# EAGLE design MICamp (EAGLE 4.16)
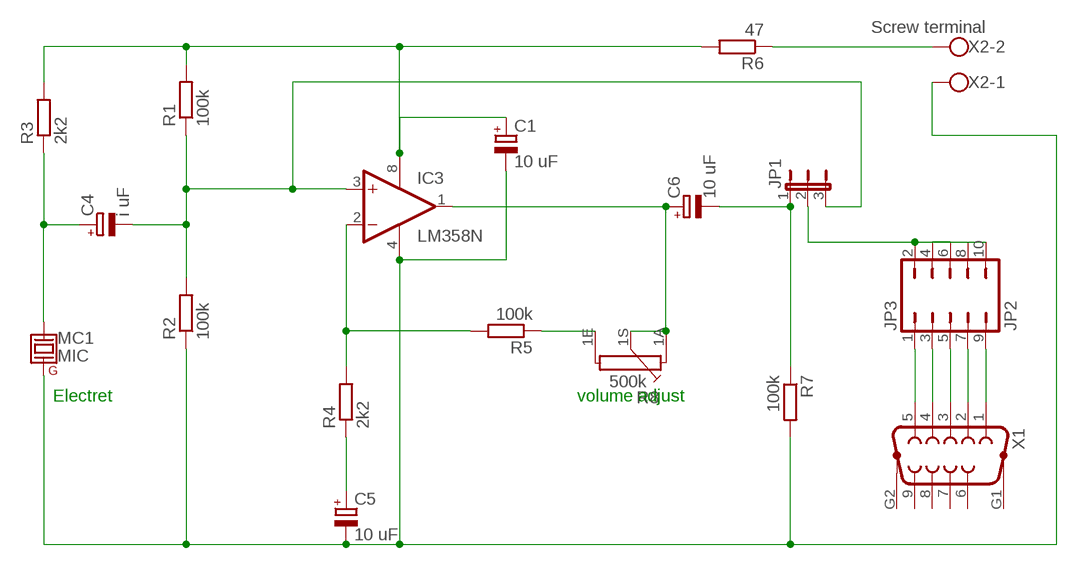
[diagram p0: schematic, sheet 1]

## Parts
C1  10 uF  CPOL-EUE2.5-5  [E2,5-5]
C4  i uF  CPOL-EUE2.5-5  [E2,5-5]
C5  10 uF  CPOL-EUE2.5-5  [E2,5-5]
C6  10 uF  CPOL-EUE2.5-5  [E2,5-5]
IC3  LM358N  [DIL08]
JP1  JP2E  [JP2]
JP3  JP2  JP5Q  [JP5Q]
MC1  MIC  [MIC]
R1  100k  R-EU_0207/10  [0207/10]
R2  100k  R-EU_0207/10  [0207/10]
R3  2k2  R-EU_0207/10  [0207/10]
R4  2k2  R-EU_0207/10  [0207/10]
R5  100k  R-EU_0207/10  [0207/10]
R6  47  R-EU_0207/10  [0207/10]
R7  100k  R-EU_0207/10  [0207/10]
R8  500k  PC16-SHM2  [PC16-SHM2]
X1  F09HP  [F09HP]
X2  Screw terminal  W237-102  [W237-102]

## Nets
JP2: JP3.1 X1.5
N$1: C4.- IC3.3(+IN) JP1.3 R1.1 R2.2
N$2: IC3.2(-IN) R4.2 R5.2
N$3: C1.+ IC3.8(V+) R1.2 R3.2 R6.2
N$4: C4.+ MC1.1 R3.1
N$5: C5.+ R4.1
N$6: R6.1 X2.2
N$7: C6.- JP1.1 R7.1
N$8: C1.- C5.- IC3.4(V-) MC1.2 R2.1 R7.2 X2.1
N$9: R5.1 R8.1E
N$10: C6.+ IC3.1(OUT) R8.1A R8.1S
N$11: JP1.2 JP3.2 JP3.4 JP3.6 JP3.8 JP3.10
N$12: JP3.3 X1.4
N$13: JP3.5 X1.3
N$14: JP3.7 X1.2
N$15: JP3.9 X1.1
Unconnected: R8.M1 R8.M2 R8.M3 R8.M4 X1.6 X1.7 X1.8 X1.9 X1.G1 X1.G2

## Notes on the sheet
- Electret | volume adjust

## Library data of the parts
C1 C4-C6 = bert:CPOL-EU: POLARIZED CAPACITOR, European symbol
IC3 = bert:LM358: OP AMP also LM158; LM258; LM2904 Source: http://cache.national.com/ds/LM/LM158.pdf
JP1 = jumper:JP2E: JUMPER
JP3 = jumper:JP5Q: JUMPER
MC1 = bert:MIC
R1-R7 = bert:R-EU_: RESISTOR, European symbol
R8 = bert:PC16-SHM2: POTENTIOMETER single carbon potentiometer, 16 mm, S3ROH
X1 = con-subd:F09HP: SUB-D
X2 = bert:W237-102: WAGO SCREW CLAMP

## Board
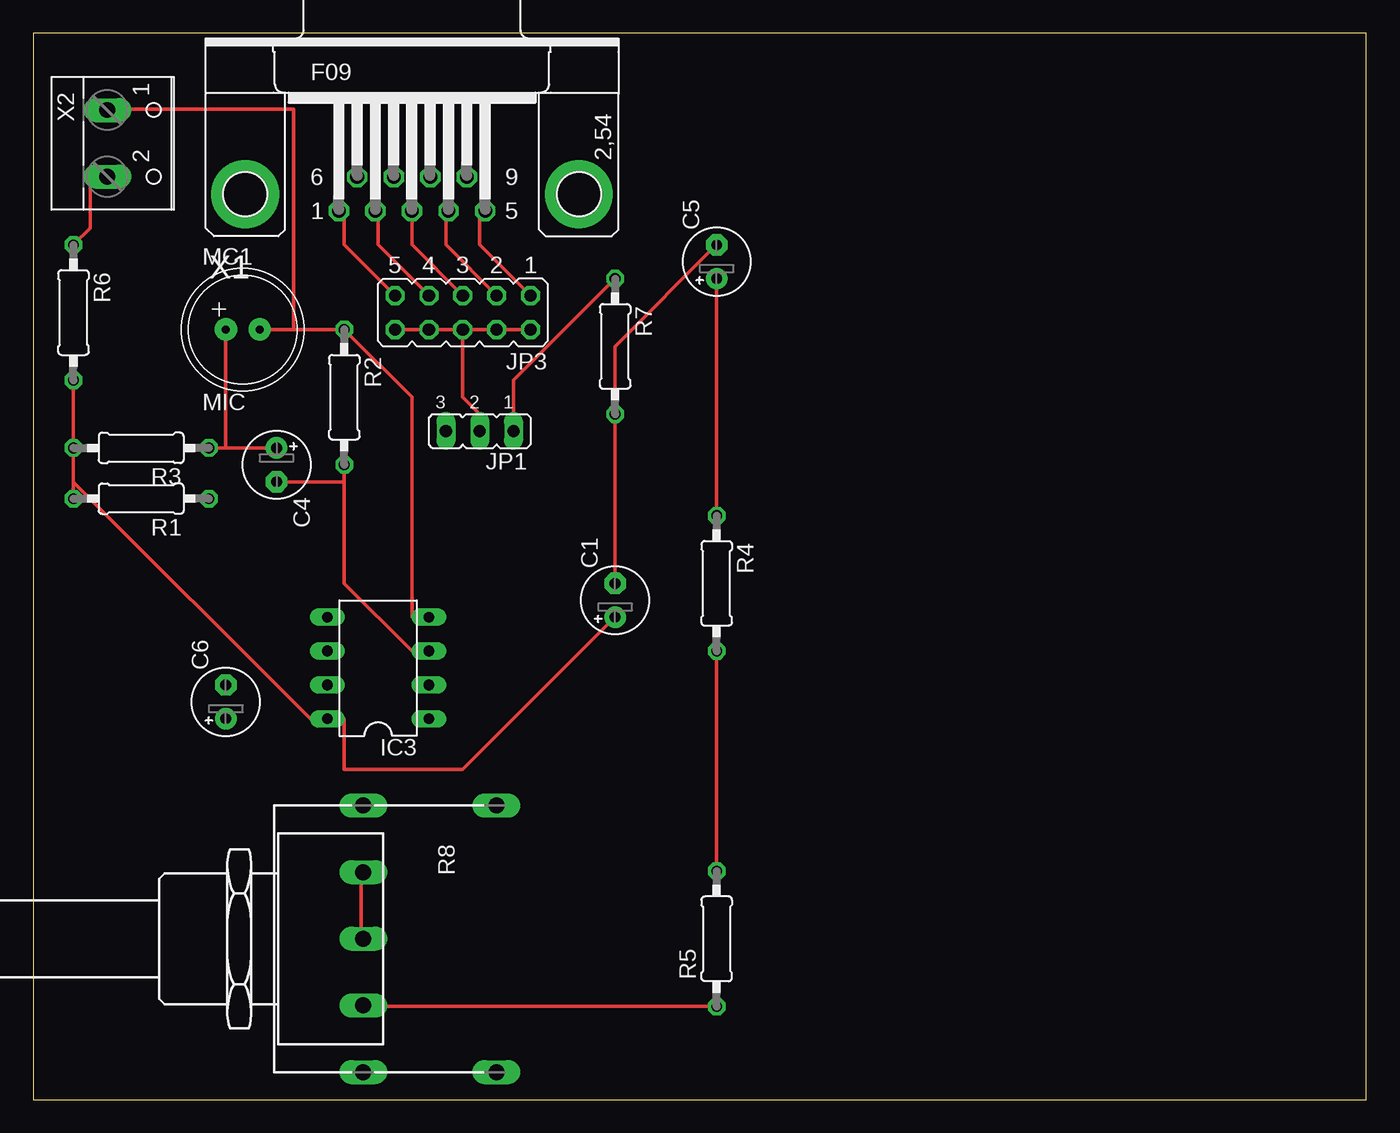
[diagram p1: board, top side]
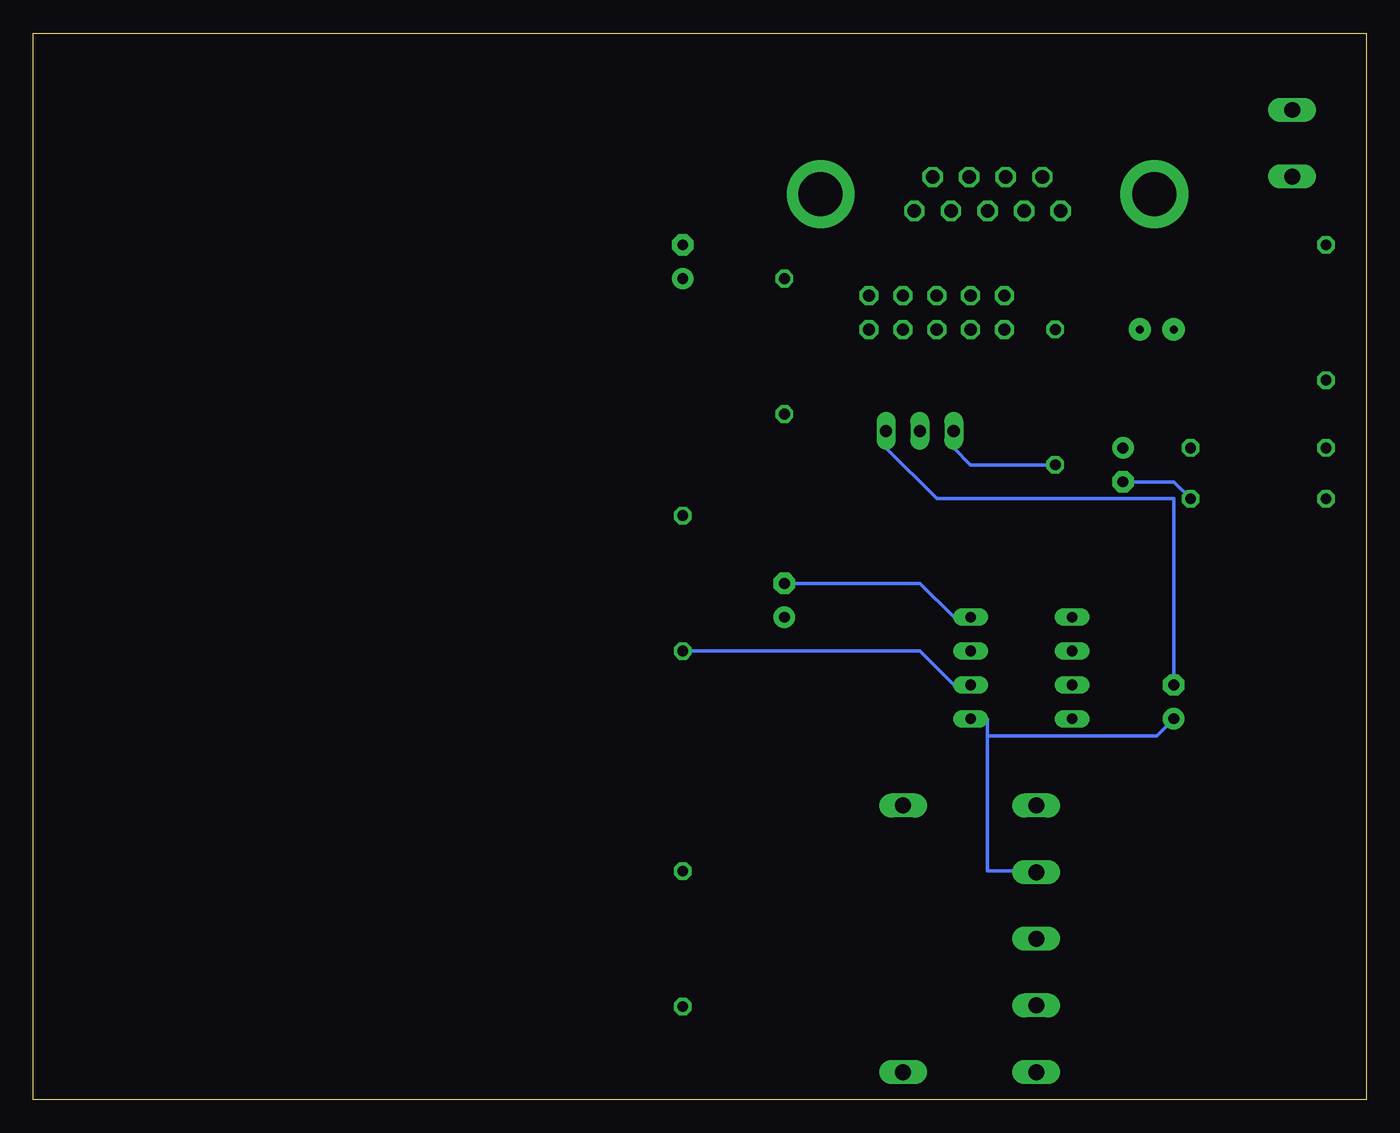
[diagram p2: board, bottom side, seen from below]

Size 100 x 80 mm. Coordinates in mm from the lower left corner, seen from the top.
Outline: 0,0 100,0 100,80 0,80 0,0
Copper layers (1*16): Top 0.035mm / dielectric 1.5mm / Bottom 0.035mm
Design rules "default": minimum track width 10mil, minimum drill 24mil, track to track 8mil, track to pad 8mil, pad to pad 8mil, via to via 8mil, smd to smd 8mil, copper to edge 40mil, drill to drill 8mil, minimum pad ring 10mil, minimum via ring 8mil, stop-mask expansion 4mil, vias tented up to drill 0mil, thermal gap 10mil

### Footprints (pad centres in the part's own frame; a part is rotated, then mirrored left to right if it is on the bottom)
E2,5-5 = drill 0.813 pad 1.6 round: + -1.27,0 | drill 0.813 pad 1.6 octagon: - 1.27,0
DIL08 = drill 0.813 long: 1 -3.81,-3.81; 2 -1.27,-3.81; 3 1.27,-3.81; 4 3.81,-3.81; 5 3.81,3.81; 6 1.27,3.81; 7 -1.27,3.81; 8 -3.81,3.81
JP2 = drill 0.914 long: 1 -2.54,0; 2 0,0; 3 2.54,0
JP5Q = drill 0.914 octagon: 1 -5.08,-1.27; 2 -5.08,1.27; 3 -2.54,-1.27; 4 -2.54,1.27; 5 0,-1.27; 6 0,1.27; 7 2.54,-1.27; 8 2.54,1.27; 9 5.08,-1.27; 10 5.08,1.27
MIC = drill 0.61 pad 1.676 round: 1 -1.27,0; 2 1.27,0
0207/10 = drill 0.813 octagon: 1 -5.08,0; 2 5.08,0
PC16-SHM2 = drill 1.2 long: 1A -5,6.5; 1E 5,6.5; 1S 0,6.5; M1 -10,6.5; M2 10,6.5; M3 10,16.5; M4 -10,16.5
F09HP = drill 1.016 octagon: 1 -5.486,-1.27; 2 -2.743,-1.27; 3 0,-1.27; 4 2.743,-1.27; 5 5.486,-1.27; 6 -4.115,1.27; 7 -1.372,1.27; 8 1.372,1.27; 9 4.115,1.27 | drill 3.302 pad 5.08 round: G1 -12.522,0; G2 12.522,0
W237-102 = drill 1.194 long: 1 -2.5,-1.27; 2 2.5,-1.27

### Placement (x,y rotation side)
C1  43.65,37.46 90 top
C4  18.25,47.62 270 top
C5  51.27,62.86 90 top
C6  14.44,29.84 90 top
IC3  25.87,32.38 90 top
JP1  33.49,50.16 180 top
JP3  32.22,59.05 180 top
MC1  15.71,57.78 0 top
R1  8.09,45.08 180 top
R2  23.33,52.7 270 top
R3  8.09,48.89 180 top
R4  51.27,38.73 270 top
R5  51.27,12.06 90 top
R6  3.01,59.05 270 top
R7  43.65,56.51 270 top
R8  18.25,12.06 270 top
X1  28.41,67.94 0 top
X2  6.82,71.75 270 top

### Tracks (layer width: path | path; a pad name or v marks a point on that pad's centre or on a via)
JP2
  Top 0.254: JP3.1 33.49,64.13 33.49,66.67 X1.5
N$1
  Top 0.254: 23.33,46.35 R2.2 | 23.33,46.35 23.33,38.73 28.41,33.65 IC3.3 | C4.- 23.33,46.35
  Bottom 0.254: R1.1 14.44,46.35 C4.- | R2.2 29.68,47.62 30.95,48.89 JP1.3
N$2
  Top 0.254: R4.2 R5.2
  Bottom 0.254: R4.2 33.49,33.65 30.95,31.11 IC3.2
N$3
  Top 0.254: 3.01,46.35 20.79,28.57 IC3.8 23.33,28.57 23.33,24.76 32.22,24.76 C1.+ | 3.01,46.35 R3.2 R6.2 | R1.2 3.01,46.35
N$4
  Top 0.254: 14.44,48.89 C4.+ | R3.1 14.44,48.89 | 14.44,48.89 MC1.1
N$5
  Top 0.254: R4.1 C5.+
N$6
  Top 0.254: R6.1 4.28,65.4 4.28,69.21 X2.2
N$7
  Top 0.254: R7.1 36.03,53.97 JP1.1
  Bottom 0.254: C6.- 14.44,45.08 32.22,45.08 36.03,48.89 JP1.1
N$8
  Top 0.254: 19.52,57.78 MC1.2 | 19.52,57.78 R2.1 28.41,52.7 28.41,36.19 IC3.4 | 19.52,57.78 19.52,74.29 6.82,74.29 X2.1 | C1.- R7.2 43.65,56.51 C5.-
  Bottom 0.254: C1.- 33.49,38.73 30.95,36.19 IC3.4
N$9
  Top 0.254: R5.1 25.87,6.98 R8.1E
N$10
  Top 0.254: R8.1S 24.6,12.06 24.6,17.14 R8.1A
  Bottom 0.254: 28.41,27.3 28.41,17.14 25.87,17.14 R8.1A | 28.41,27.3 28.41,28.57 IC3.1 | C6.+ 15.71,27.3 28.41,27.3
N$11
  Top 0.254: JP3.10 JP3.8 JP3.6 | JP3.6 32.22,52.7 33.49,51.43 JP1.2 | JP3.6 JP3.4 JP3.2
N$12
  Top 0.254: JP3.3 30.95,64.13 30.95,66.67 X1.4
N$13
  Top 0.254: JP3.5 28.41,64.13 X1.3
N$14
  Top 0.254: JP3.7 25.87,64.13 25.87,66.67 X1.2
N$15
  Top 0.254: JP3.9 23.33,64.13 23.33,66.67 X1.1